# Altium schematic sheet TopSheet.SchDoc
size A4; CompanyName: Technische Hochschule Nürnberg Georg Simon Ohm; Organization: UltraZohm; Address1: Kesslerplatz 12; Address2: 90489 Nürnberg; Address3: GERMANY; DocumentNumber: 1; SheetNumber: 1; SheetTotal: 2; Website: www.ultrazohm.com
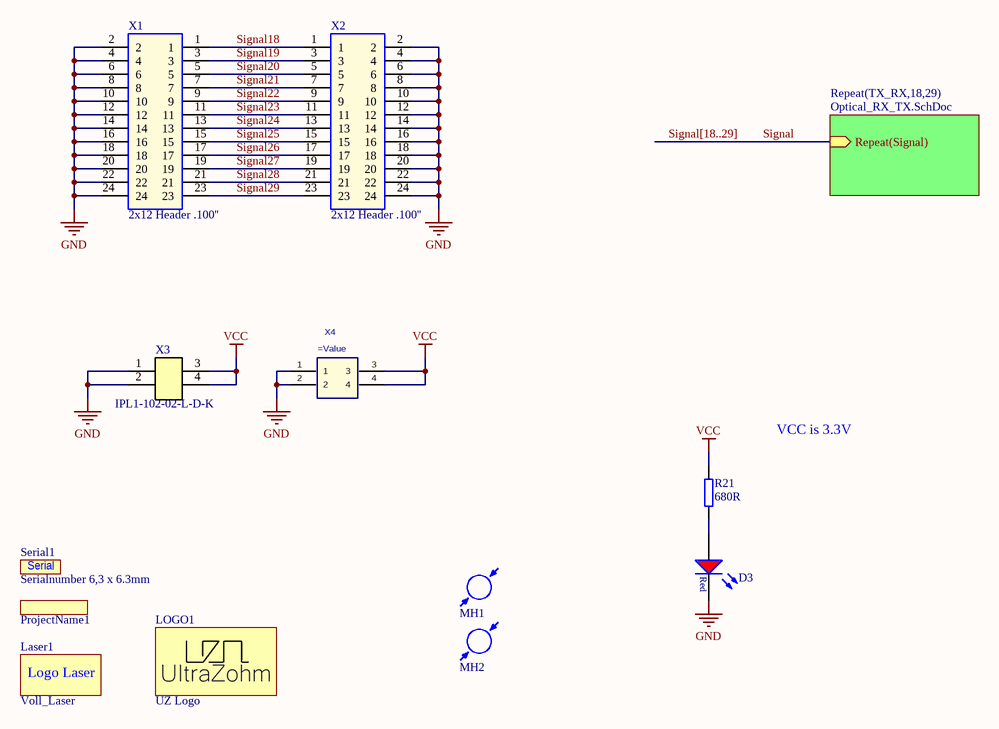
[diagram p0: TopSheet.SchDoc]

## Parts
D3  150060RS75000  [WL-SMCW_0603]  (value not drawn)
Laser1  Voll_Laser  [Voll_Laser]  (no BOM)
LOGO1  UZ Logo  [UZ_Logo_small]  (no BOM)
MH1  (no value)  [MH_2.8]  (no BOM)
MH2  (no value)  [MH_2.8]  (no BOM)
ProjectName1  Project Name, Rev  [ID_ProjectRev]  (value not drawn)  (no BOM)
R21  680R  [R_0603_N]
Serial1  Serialnumber 6,3 x 6.3mm  [Serial_6.3x6.3mm]  (no BOM)
X1  2x12 Header .100''  [TST-112-01-G-D]
X2  2x12 Header .100''  [TST-112-01-G-D]
X3  IPL1-102-02-L-D-K  [IPL1-102-02-L-D-K-0]
X4  (no value)  [IPL1-102-01-L-D-K]

## Sub-sheets
Repeat(TX_RX,18,29) = Optical_RX_TX.SchDoc: Repeat(Signal) (in)

## Nets
GND: D3.1(K) X1.2 X1.4 X1.6 X1.8 X1.10 X1.12 X1.14 X1.16 X1.18 X1.20 X1.22 X1.24 X2.2 X2.4 X2.6 X2.8 X2.10 X2.12 X2.14 X2.16 X2.18 X2.20 X2.22 X2.24 X3.1 X3.2 X4.1 X4.2
VCC: R21.2 X3.3 X3.4 X4.3 X4.4
Signal: sheet Repeat(TX_RX,18,29)/Repeat(Signal)
Signal18: X1.1 X2.1
Signal19: X1.3 X2.3
Signal20: X1.5 X2.5
Signal21: X1.7 X2.7
Signal22: X1.9 X2.9
Signal23: X1.11 X2.11
Signal24: X1.13 X2.13
Signal25: X1.15 X2.15
Signal26: X1.17 X2.17
Signal27: X1.19 X2.19
Signal28: X1.21 X2.21
Signal29: X1.23 X2.23
NetD3_2: D3.2(A) R21.1

## Buses and harness runs
bus Signal[18..29]

## Notes on the sheet
- VCC is 3.3V
- Title
- Revision:
- Design Engineer:
- Date:
- Project:
- Sheet
- of
- (in symbol SerialNumber) Serial
- (in symbol Voll_Laser) Logo Laser

## Library data of the parts
D3 = LED_Red_0603: WL-SMCW SMD Mono-color Chip LED Waterclear, size 0603, Red, 2 V, 140°; Forward Voltage: 2 V; Luminous Intensity: 250 mcd; Peak Wavelength: 630 nm; Dominant Wavelength: 625 nm; MF: Wuerth Elektronik; Published Date: Sep. 2017; ComponentLink1Description: Manufacturer; ComponentLink1URL: http://www.we-online.de; ComponentLink2Description: Datasheet; ComponentLink2URL: http://katalog.we-online.com/led/datasheet/150060RS75000.pdf; MPN: 150060RS75000; Size: 0603; Viewing Angle: 140°; Emitting Color: Red; Value: 150060RS75000; Package: 0603; Created: 2018_09_06_AGeiger; Supplier 1: Farnell; Supplier Part Number 1: 2322071; Supplier 2: Mouser; Supplier Part Number 2: 710-150060RS75000; Supplier 3: Digi-Key; Supplier Part Number 3: 732-4978-1-ND; LCSC Part Number: C2286
Laser1 = Voll_Laser: Logo Laser Warning Sign
LOGO1 = UZ Logo: UltraZohm Logo on PCB; Created: Jan2021_Liegmann; Value: UZ Logo
MH1 MH2 = Mounting Hole: Non plated through hole
ProjectName1 = ID_ProjectRev: Project Name and Revision Number; Created: 2018_11_23_AGeiger; Value: Project Name, Rev
R21 = R_0603: SMD Resistor 0603; MPN: CR0603-FX-3901ELF; Tolerance: 1%; Voltage: 75V; Power: 100 mW; MF: Bourns; Package: 0603; Value: 680R; Created: 2018_09_06_AGeiger; Supplier 1: Mouser; Supplier Part Number 1: 652-CR0603-FX3901ELF; LCSC Part Number: C23228
Serial1 = SerialNumber: Created: 2018_09_18_AGeiger; Value: Serialnumber 6,3 x 6.3mm
X1 X2 = TST-112-01-G-D: Double Row, 12 positions, Shrouded Terminal Header .100''; MF: Samtec; Created: 2020_04_Kreppel; MPN: TST-112-01-G-D; Supplier 1: Mouser; Supplier Part Number 1: 200-TST11201GD; LCSC Part Number: C5372869
X3 = IPL1-102-02-L-D-K: P=2.54mm Wire To Board Connector ROHS; Manufacturer: SAMTEC; Created from: KIlhan; Number of positions: 2; Manufacturer Part Number: IPL1-102-02-L-D-K; PartID: 59; Created On: 20/03/2025 08:58:37; ComponentLink1Description: Datasheet; ComponentLink1URL: https://wmsc.lcsc.com/wmsc/upload/file/pdf/v2/lcsc/2312312026_Samtec-IPL1-102-02-L-D-K_C7437440.pdf; Component Type: Samtec Connector; Device Package: Connector; Last Updated: 20/03/2025 09:02:48; Mounting Type: THT; Operating Temperature: -55 - +125 °C; Supplier 1: Mouser; Supplier Part Number 1: 200-IPL110202LDK; Supplier 2: LCSC; Supplier Part Number 2: C7437440; Type: Connector; Live Cycle Status: 1; Number of rows: 2; LCSC Part Number: C7437440; Stock number: not stored
X4 = IPL1-102-XX-X-D-X: 2.54mm Double Row Terminal Assembly, Right-Angled; Manufacturer: SAMTEC; Created: 2018_05_02_AGeiger; Value: =MPN; MPN: IPL1-102-01-L-D-K; LCSC Part Number: C5714565